# EAGLE design esp8266_relay_board (EAGLE 6.3)
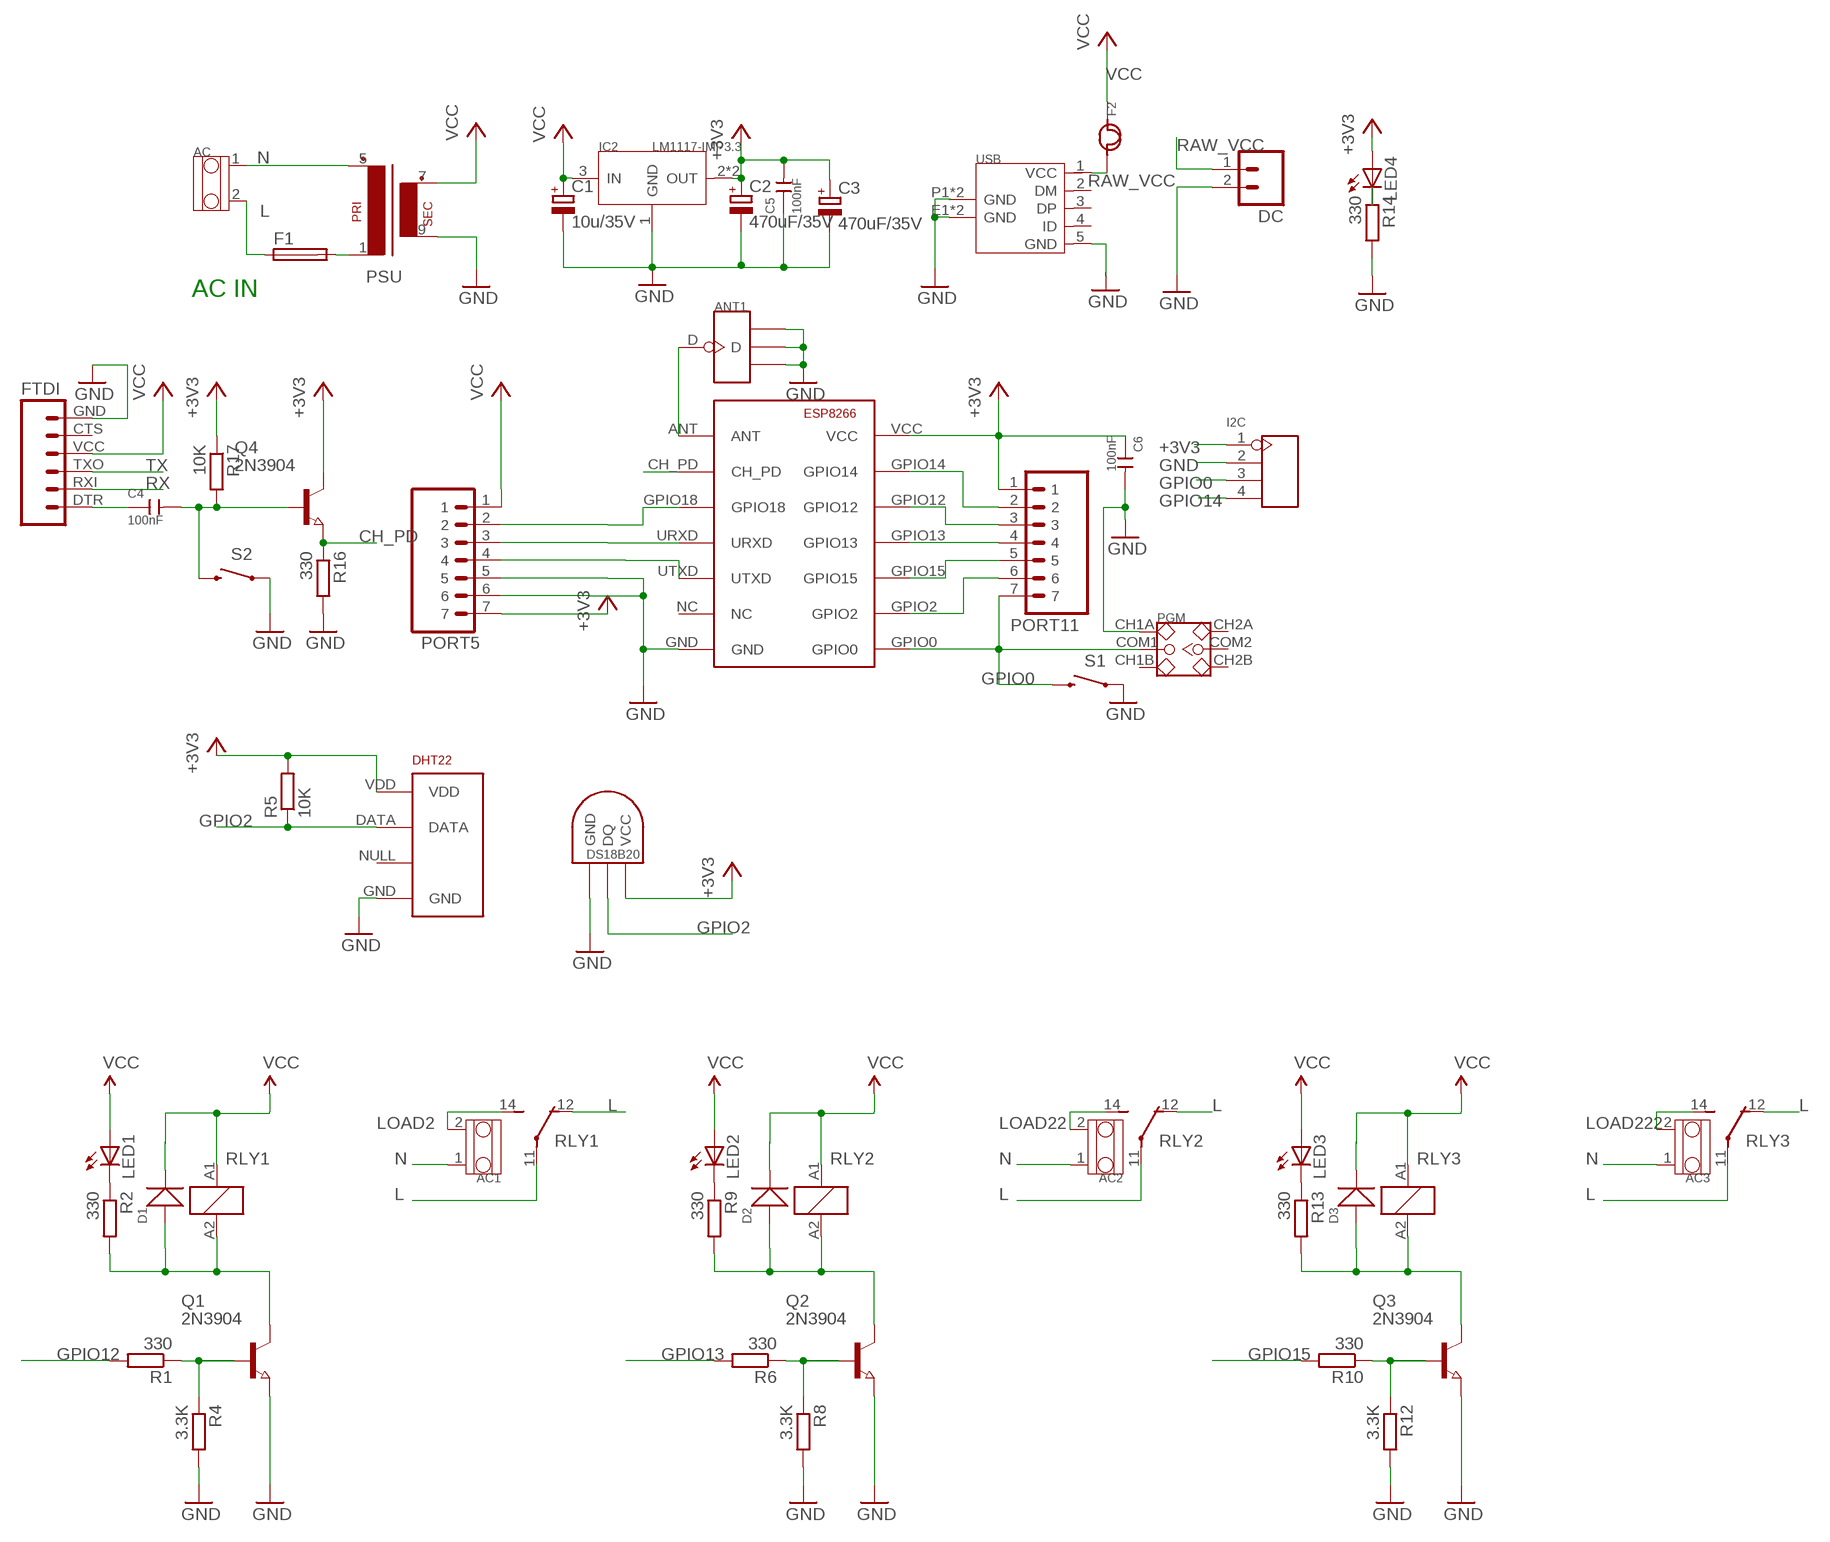
[diagram p0: schematic, sheet 1]

## Parts
AC  SCREW-TERMINAL-2P-3470110P1  [2P-5.0]
AC1  SCREW-TERMINAL-2P-3470110P1  [2P-5.0]
AC2  SCREW-TERMINAL-2P-3470110P1  [2P-5.0]
AC3  SCREW-TERMINAL-2P-3470110P1  [2P-5.0]
ANT1  U-FL-CONNECTOR-3450020P1  [U-FL]
C1  10u/35V  CPOL-EUSMCC  [SMC_C]
C2  470uF/35V  CPOL-EUSMCC  [SMC_C]
C3  470uF/35V  CPOL-EUSMCC  [SMC_C]
C4  100nF  CAP-0603  [C0603]
C5  100nF  CAP-0603  [C0603]
C6  100nF  CAP-0603  [C0603]
D1  DIODE'1206'  [SOD-123]
D2  DIODE'1206'  [SOD-123]
D3  DIODE'1206'  [SOD-123]
DC  M02LOCK  [1X02_LOCK]
DHT22  RHT03_DHT-22_AM2302  [RHT03_DHT-22]
ESP8266  ESP8266  ESP8266-04  [ESP-04]
F1  FUSEBLANK_5X20MM  [FUSE_HOLDER_5X20MM]
F2  FUSE-1206  [F1206]
FTDI  FTDI_BASICPTH  [FTDI_BASIC]
I2C  HEADER-4P-65/35MIL  [4P-2.54-65/35MIL]
IC2  LM1117-IMP3.3  CJ1117-3.3-1310190P1  [SOT223]
LED1  LEDSML0603  [SML0603]
LED2  LEDSML0603  [SML0603]
LED3  LEDSML0603  [SML0603]
LED4  LEDSML0603  [SML0603]
PGM  SWITCH-2CH-6P-90D  [6P-2CH-2.54-L9.0XW3.5XH3.2-90D]
PORT5  CON7PIN-PAD  [PORT7PAD]
PORT11  CON7PIN-PAD  [PORT7PAD]
PSU  VV11  [VV11]
Q1  2N3904  NPN-TRANSISTOR_SOT23  [SOT23]
Q2  2N3904  NPN-TRANSISTOR_SOT23  [SOT23]
Q3  2N3904  NPN-TRANSISTOR_SOT23  [SOT23]
Q4  2N3904  NPN-TRANSISTOR_SOT23  [SOT23]
R1  330  R-EU_R0603  [R0603]
R2  330  R-EU_R0603  [R0603]
R4  3.3K  R-EU_R0603  [R0603]
R5  10K  R-EU_R0603  [R0603]
R6  330  R-EU_R0603  [R0603]
R8  3.3K  R-EU_R0603  [R0603]
R9  330  R-EU_R0603  [R0603]
R10  330  R-EU_R0603  [R0603]
R12  3.3K  R-EU_R0603  [R0603]
R13  330  R-EU_R0603  [R0603]
R14  330  R-EU_R0603  [R0603]
R16  330  R-EU_R0603  [R0603]
R17  10K  R-EU_R0603  [R0603]
RLY1  RT114005  [RT-C/O12A3.5]
RLY2  RT114005  [RT-C/O12A3.5]
RLY3  RT114005  [RT-C/O12A3.5]
S1  !RESET  SWITCH-MOMENTARY-2SMD  [TACTILE_SWITCH_SMD]
S2  !RESET  SWITCH-MOMENTARY-2SMD  [TACTILE_SWITCH_SMD]
U$1  DS1820TO92  [DS1820]
USB  MICRO-USB-5P-340015001  [B-SMD-5P]

## Nets
+3V3 [power]: C2.+ C3.+ C5.2 C6.1 DHT22.VDD ESP8266.VCC I2C.1 IC2.2(OUT) IC2.TER(OUT) LED4.A PORT5.7 PORT11.1 Q4.3(C) R5.2 R17.1 U$1.VDD(VCC)
CH_PD [power]: ESP8266.CH_PD Q4.2(E) R16.1
GND [power]: ANT1.GND1 ANT1.GND2 ANT1.GND3 C1.- C2.- C3.- C5.1 C6.2 DC.2 DHT22.GND ESP8266.GND FTDI.GND I2C.2 IC2.1(GND) PGM.CH1A PORT5.5 PORT5.6 PSU.9(S4) Q1.2(E) Q2.2(E) Q3.2(E) R4.2 R8.2 R12.2 R14.2 R16.2 S1.1 S2.1 U$1.GND USB.5(GND) USB.E1(GND) USB.E2(GND) USB.P1(GND) USB.P2(GND)
GPIO0: ESP8266.GPIO0 I2C.3 PGM.COM1 PORT11.7 S1.3
GPIO2: DHT22.DATA ESP8266.GPIO2 PORT11.6 R5.1 U$1.DQ
GPIO12: ESP8266.GPIO12 PORT11.3 R1.2
GPIO13: ESP8266.GPIO13 PORT11.4 R6.2
GPIO14: ESP8266.GPIO14 I2C.4 PORT11.2
GPIO15 [power]: ESP8266.GPIO15 PORT11.5 R10.2
GPIO16: ESP8266.GPIO18 PORT5.2
L [220V Traf]: AC.2 F1.1 RLY1.11(2:P) RLY1.12(2:O) RLY2.11(2:P) RLY2.12(2:O) RLY3.11(2:P) RLY3.12(2:O)
LOAD2 [220V]: AC1.2 RLY1.14(2:S)
LOAD22 [220V]: AC2.2 RLY2.14(2:S)
LOAD222 [220V]: AC3.2 RLY3.14(2:S)
N [220V Traf]: AC1.1 AC2.1 AC3.1 AC.1 PSU.5(P2)
N$1: Q1.1(B) R1.1 R4.1
N$2: Q2.1(B) R6.1 R8.1
N$4: LED2.C R9.1
N$6 [power]: D2.+ Q2.3(C) R9.2 RLY2.A2
N$8: LED1.C R2.1
N$9: Q3.1(B) R10.1 R12.1
N$10: LED3.C R13.1
N$12 [power]: D3.+ Q3.3(C) R13.2 RLY3.A2
N$13: C4.1 FTDI.DTR
N$15 [220V Traf]: F1.2 PSU.1
N$16: LED4.C R14.1
N$17 [antenna]: ANT1.D ESP8266.ANT
N$19 [power]: D1.+ Q1.3(C) R2.2 RLY1.A2
N$20: C4.2 Q4.1(B) R17.2 S2.3
RAW_VCC [power]: DC.1 F2.2 USB.1(VCC)
RX: ESP8266.UTXD FTDI.RXI PORT5.4
TX: ESP8266.URXD FTDI.TXO PORT5.3
VCC [power]: C1.+ D1.- D2.- D3.- F2.1 FTDI.VCC IC2.3(IN) LED1.A LED2.A LED3.A PORT5.1 PSU.7(S3) RLY1.A1 RLY2.A1 RLY3.A1
Unconnected: DHT22.NULL ESP8266.NC FTDI.CTS PGM.CH1B PGM.CH2A PGM.CH2B PGM.COM2 USB.2(DM) USB.3(DP) USB.4(ID)

## Notes on the sheet
- AC IN

## Library data of the parts
AC AC1-AC3 = Connector:SCREW-TERMINAL-2P
ANT1 = Connector:U-FL-CONNECTOR
C1-C3 = rcl:CPOL-EU: POLARIZED CAPACITOR, European symbol
C4-C6 = Discrete:CAP: Ceramic Capacitors
D1-D3 = Discrete:DIODE*
DC = SparkFun-Connectors:M02: Standard 2-pin 0.1" header. Use with - straight break away headers ( PRT-00116) - right angle break away headers (PRT-00553) - swiss pins (PRT-00743) - machine pins (PRT-00117) - female headers (PRT-00115) Molex polarized connector foot print use with: PRT-08233 with associated crimp pins and housings. 2.54_SCREWTERM for use with PRT-10571. 3.5mm Screw Terminal footprints for PRT-08084 5mm Screw Terminal footprints for use with PRT-08433
DHT22 = RHT03_DHT-22_AM2302:RHT03_DHT-22_AM2302: RHT03 / DHT-22 / AM2302 Packages and symbol for the RHT03 / DHT-22 relative humidity and temperature sensor. Note: The AM2302 is a wired version of the DHT-22 which typically requires less clearance and is thus provided as a separate package.; PROD_ID: SEN-10167
ESP8266 = ESP8266:ESP8266: low cost Wifi to Serial Module
F1 = fuse:FUSE: Fuse; OC_FARNELL: unknown; OC_NEWARK: unknown
F2 = Discrete:FUSE
FTDI = SparkFun:FTDI_BASIC: FTDI Basic: 3.3V and 5V
I2C = Connector:HEADER-4P
IC2 = IC:CJ1117-3.3: 1A Low Dropout Linear Regulator
LED1-LED4 = led:LED: LED OSRAM: - CHIPLED LG R971, LG N971, LY N971, LG Q971, LY Q971, LO R971, LY R971 LH N974, LH R974 LS Q976, LO Q976, LY Q976 LO Q996 - Hyper CHIPLED LW Q18S LB Q993, LB Q99A, LB R99A - SideLED LS A670, LO A670, LY A670, LG A670, LP A670 LB A673, LV A673, LT A673, LW A673 LH A674 LY A675 LS A676, LA A676, LO A676, LY A676, LW A676 LS A679, LY A679, LG A679 - Hyper Micro SIDELED® LS Y876, LA Y876, LO Y876, LY Y876 LT Y87S - SmartLED LW L88C, LW L88S LB L89C, LB L89S, LG L890 LS L89K, LO L89K, LY L89K LS L896, LA L896, LO L896, LY L896 - TOPLED LS T670, LO T670, LY T670, LG T670, LP T670 LSG T670, LSP T670, LSY T670, LOP T670, LYG T670 LG T671, LOG T671, LSG T671 LB T673, LV T673, LT T673, LW T673 LH T674 LS T676, LA T676, LO T676, LY T676, LB T676, LH T676, LSB T676, LW T676 LB T67C, LV T67C, LT T67C, LS T67K, LO T67K, LY T67K, LW E67C LS E67B, LA E67B, LO E67B, LY E67B, LB E67C, LV E67C, LT E67C LW T67C LS T679, LY T679, LG T679 LS T770, LO T770, LY T770, LG T770, LP T770 LB T773, LV T773, LT T773, LW T773 LH T774 LS E675, LA E675, LY E675, LS T675 LS T776, LA T776, LO T776, LY T776, LB T776 LHGB T686 LT T68C, LB T68C - Hyper Mini TOPLED® LB M676 - Mini TOPLED Santana® LG M470 LS M47K, LO M47K, LY M47K Source: http://www.osram.convergy.de LUXEON: - LUMILED® LXK2-PW12-R00, LXK2-PW12-S00, LXK2-PW14-U00, LXK2-PW14-V00 LXK2-PM12-R00, LXK2-PM12-S00, LXK2-PM14-U00 LXK2-PE12-Q00, LXK2-PE12-R00, LXK2-PE12-S00, LXK2-PE14-T00, LXK2-PE14-U00 LXK2-PB12-K00, LXK2-PB12-L00, LXK2-PB12-M00, LXK2-PB14-N00, LXK2-PB14-P00, LXK2-PB14-Q00 LXK2-PR12-L00, LXK2-PR12-M00, LXK2-PR14-Q00, LXK2-PR14-R00 LXK2-PD12-Q00, LXK2-PD12-R00, LXK2-PD12-S00 LXK2-PH12-R00, LXK2-PH12-S00 LXK2-PL12-P00, LXK2-PL12-Q00, LXK2-PL12-R00 Source: www.luxeon.com KINGBRIGHT: KA-3528ASYC Source: www.kingbright.com
PGM = Discrete:SWITCH-2CH-6P: 6P-2CH-2.54-L9.0*W3.5*H3.2+2.0MM:311010004;6P-2CH-2.54-L9.0*W3.5*H3.2-90D:311030004;6P-2CH-2.54-SMD-L7.0*W3.5*H1.5MM:311030005
PORT5 PORT11 = Port7Pin:CON7PIN: PIN HEADER
PSU = trafo:VV11: TRANSFORMER 1 primary winding, 1 secondary winding BLOCK
Q1-Q4 = semicon-smd-ipc:NPN-TRANSISTOR_: NPN TRANSISTOR
R1 R2 R4-R6 R8-R10 R12-R14 R16 R17 = rcl:R-EU_: RESISTOR, European symbol
RLY1-RLY3 = relay:RT?1*: Power PCB Relayl SCHRACK 1 pole 12 / 16 A, DC- or AC-coi Source: http://www.schrack.com/.. 5819.pdf; MPN: RT114005; OC_FARNELL: 1629035; OC_NEWARK: 03P2411
S1 S2 = SparkFun-Electromechanical:SWITCH-MOMENTARY-2: Various NO switches- pushbuttons, reed, etc; PROD_ID: SWCH-08247
U$1 = Ava:DS1820: DS18B20 Programmable Resolution 1-Wire Digital Thermometer Description The DS18B20 digital thermometer provides 9-bit to 12-bit Celsius temperature measurements and has an alarm function with nonvolatile user-programmable upper and lower trigger points. The DS18B20 communicates over a 1-Wire® bus that by definition requires only one data line (and ground) for communication with a central microprocessor. It has an operating temperature range of -55°C to +125°C and is accurate to ±0.5°C over the range of -10°C to +85°C. In addition, the DS18B20 can derive power directly from the data line ("parasite power"), eliminating the need for an external power supply. Each DS18B20 has a unique 64-bit serial code, which allows multiple DS18B20s to function on the same 1-Wire bus. Thus, it is simple to use one microprocessor to control many DS18B20s distributed over a large area. Applications that can benefit from this feature include HVAC environmental controls, temperature monitoring systems inside buildings, equipment, or machinery, and process monitoring and control systems.
USB = Connector:MICRO-USB-5P: When you use the footprint ,place notice 46 (layer)milling ,there is some important information.

## Net classes
0 default: width 0.254 mm, drill 1 mm, clearance 0.254 mm
1 power: width 0.305 mm, drill 1 mm, clearance 0.305 mm
2 220V: width 3.81 mm, drill 1 mm, clearance 1.524 mm
3 antenna: width 0.61 mm, drill 1 mm, clearance 0.508 mm
4 220V Traf: width 2.286 mm, drill 0.8 mm, clearance 1.016 mm

## Board
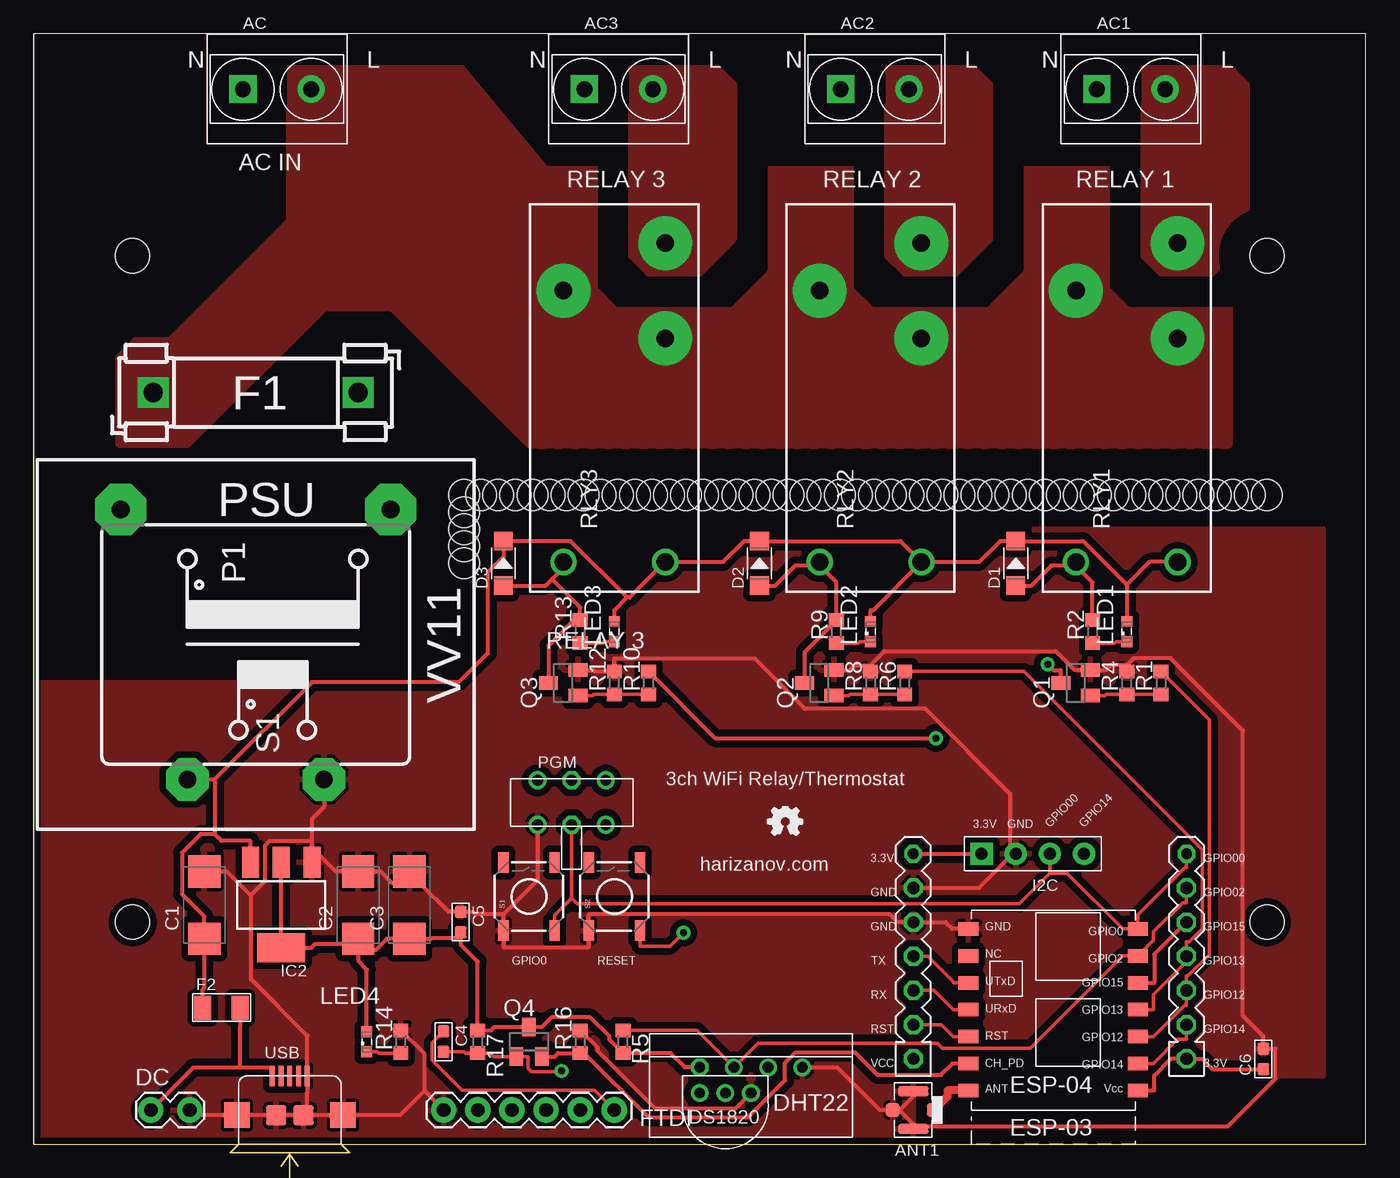
[diagram p1: board, top side]
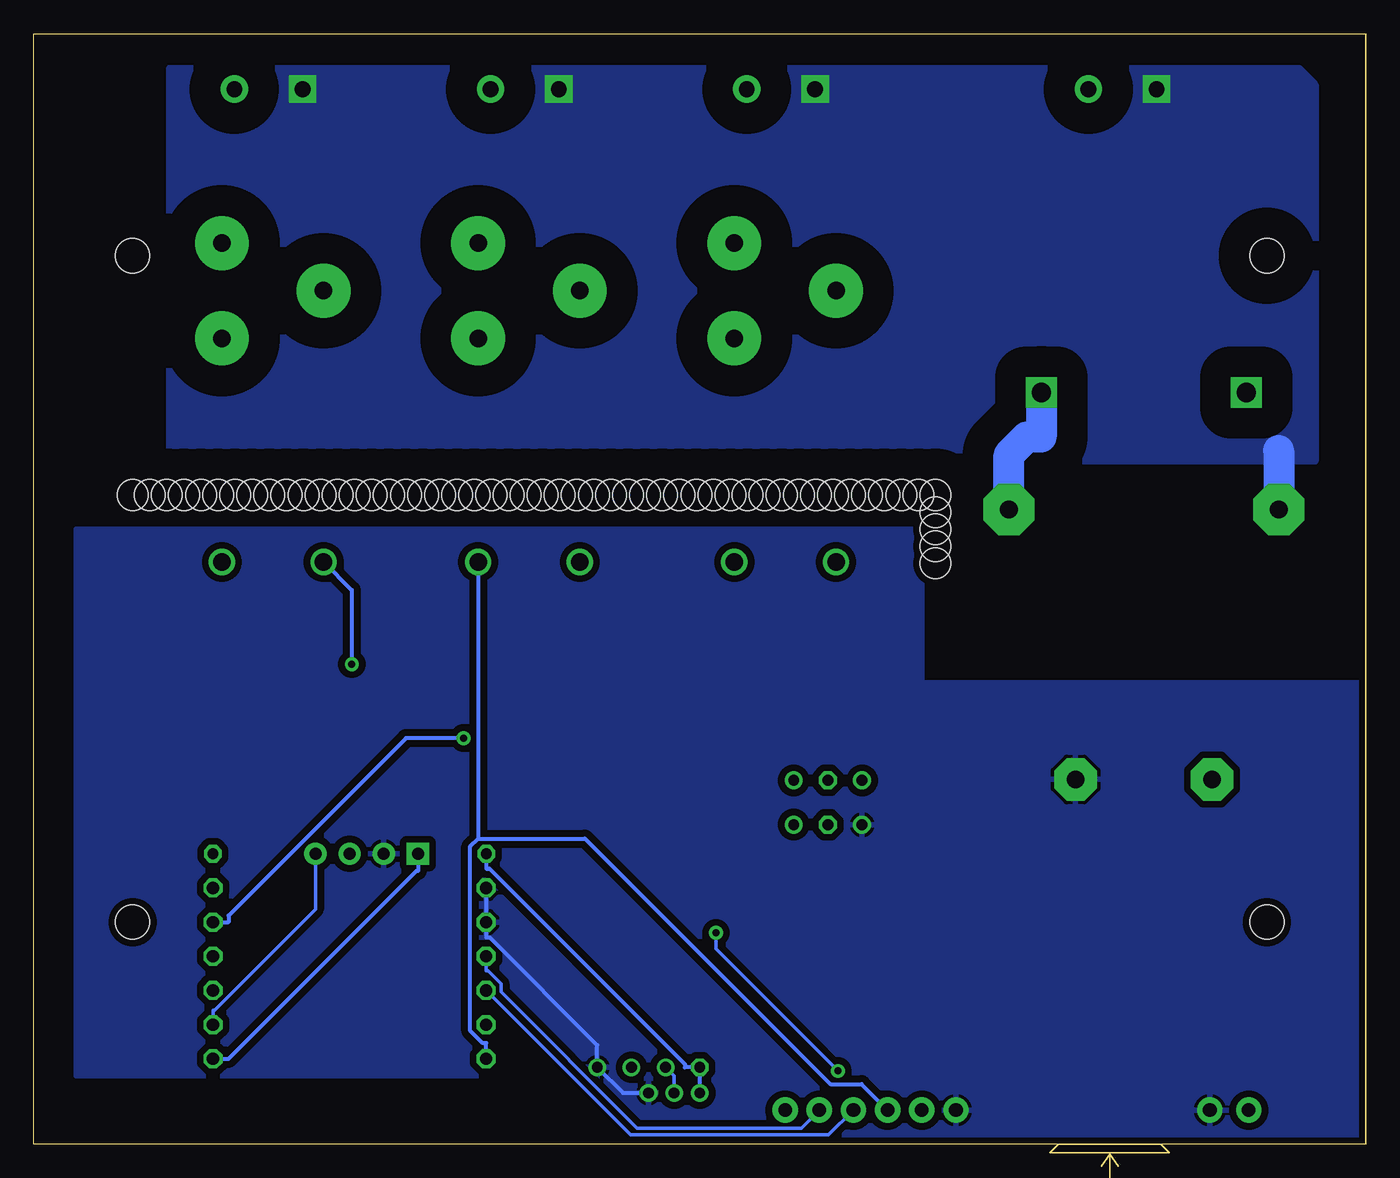
[diagram p2: board, bottom side, seen from below]

Size 99.06 x 82.55 mm. Coordinates in mm from the lower left corner, seen from the top.
Outline: 0,82.55 99.06,82.55 99.06,0 38.11,0 0,0
Outline: 0,0 0,82.55
Outline: 0,82.55 0,0
Outline: 0,0 0,82.55
Copper layers (1*16): Top 0.07mm / dielectric 2mm / Bottom 0.07mm
Design rules "default *": minimum track width 10mil, minimum drill 20mil, track to track 5mil, track to pad 5mil, pad to pad 5mil, via to via 5mil, smd to smd 0mil, copper to edge 10mil, drill to drill 10mil, minimum pad ring 10mil, minimum via ring 10mil, stop-mask expansion 2mil, vias tented up to drill 25mil, thermal gap 10mil
Holes 2.54 mm at 7.37,66.04 7.37,16.51 91.69,66.04 91.69,16.51
Holes 2.29 mm at 40.89,48.26 39.62,48.26 38.35,48.26 42.16,48.26 43.43,48.26 44.7,48.26 45.97,48.26 47.24,48.26 48.51,48.26 59.94,48.26 58.67,48.26 57.4,48.26 61.21,48.26 62.48,48.26 63.75,48.26 65.02,48.26 66.29,48.26 67.56,48.26 78.99,48.26 77.72,48.26 76.45,48.26 80.26,48.26 81.53,48.26 82.8,48.26 84.07,48.26 85.34,48.26 86.61,48.26 49.78,48.26 48.51,48.26 47.24,48.26 51.05,48.26 52.32,48.26 53.59,48.26 54.86,48.26 56.13,48.26 57.4,48.26 70.1,48.26 68.83,48.26 67.56,48.26 71.37,48.26 72.64,48.26 73.91,48.26 75.18,48.26 76.45,48.26 77.72,48.26 34.54,48.26 33.27,48.26 32,48.26 35.81,48.26 37.08,48.26 38.35,48.26 39.62,48.26 40.89,48.26 42.16,48.26 43.43,48.26 42.16,48.26 40.89,48.26 44.7,48.26 87.88,48.26 89.15,48.26 90.42,48.26 91.69,48.26 32,46.99 32,45.72 32,44.45 32,43.18
tKeepout: 2 lines
bKeepout: 2 lines
tRestrict: 2 lines
bRestrict: 2 lines

### Footprints (pad centres in the part's own frame; a part is rotated, then mirrored left to right if it is on the bottom)
2P-5.0 = drill 1.168 pad 2.032 square: 1 -2.54,0 | drill 1.168 pad 2.032: 2 2.54,0
U-FL = smd 1.016 x 1.016: D -1.524,0; GND3 1.524,0 | smd 2.286 x 0.762: GND1 0,1.397; GND2 0,-1.397
SMC_C = smd 2.4 x 2.4: + -2.5,0; - 2.5,0
C0603 = smd 0.889 x 0.889: 1 -0.762,0; 2 0.762,0
SOD-123 = smd 1.397 x 1.397: + -1.651,0; - 1.651,0
1X02_LOCK = drill 1.016 pad 1.88: 1 -0.178,0; 2 2.718,0
RHT03_DHT-22 = drill 0.8: DATA -1.27,0; GND 3.81,0; NULL 1.27,0 | drill 0.8 octagon: VDD -3.81,0
ESP-04 = smd 1 x 1.5: ANT 1.46,12.4; CH_PD 3.46,12.4; GND 13.46,12.4; GPIO0 13.46,-0.2; GPIO2 11.46,-0.2; GPIO12 5.46,-0.2; GPIO13 7.46,-0.2; GPIO14 3.46,-0.2; GPIO15 9.46,-0.2; GPIO18 5.46,12.4; NC 11.46,12.4; URXD 7.46,12.4; UTXD 9.46,12.4; VCC 1.46,-0.2
FUSE_HOLDER_5X20MM = drill 1.422 pad 2.286 square: 1 0,0; 2 15.24,0
F1206 = smd 1.27 x 1.778: 1 -1.397,0; 2 1.397,0
FTDI_BASIC = drill 1.016 pad 1.88: CTS 10.16,0; DTR 0,0; GND 12.7,0; RXI 2.54,0; TXO 5.08,0; VCC 7.62,0
4P-2.54-65/35MIL = drill 0.889 pad 1.651 square: 1 0,3.81 | drill 0.889 pad 1.651: 2 0,1.27; 3 0,-1.27; 4 0,-3.81
SOT223 = smd 1.27 x 2.286: 1 -2.286,-3.175; 2 0,-3.175; 3 2.286,-3.175 | smd 3.556 x 2.159: TER 0,3.175
SML0603 = smd 0.8 x 0.8: A 0.75,0; C -0.75,0
6P-2CH-2.54-L9.0XW3.5XH3.2-90D = drill 0.813 pad 1.27: CH1A -2.54,-1.65; CH1B 2.54,-1.65; CH2A -2.54,1.65; CH2B 2.54,1.65 | drill 0.813 pad 1.27 octagon: COM1 0,-1.65; COM2 0,1.65
PORT7PAD = drill 0.9 octagon: 1 -6.35,0; 2 -3.81,0; 3 -1.27,0; 4 1.27,0; 5 3.81,0; 6 6.35,0 | drill 0.8 octagon: 7 8.89,0
VV11 = drill 1.321 pad 3.81 octagon: 1 -10.033,10.033; 5 -10.033,-10.033 | drill 1.321 pad 3.175 octagon: 7 10.033,-5.08; 9 10.033,5.08
SOT23 = smd 1 x 1.4: 1 -0.95,-1.1; 2 0.95,-1.1; 3 0,1.1
R0603 = smd 1 x 1.1: 1 -0.85,0; 2 0.85,0
RT-C/O12A3.5 = drill 1.3 pad 4: 11 7.56,3.78; 12 4.02,-3.78; 14 11.1,-3.78 | drill 1.3: A1 -12.6,-3.78; A2 -12.6,3.78
TACTILE_SWITCH_SMD = smd 1.524 x 0.762: 1 -2.54,1.905; 2 2.54,1.905; 3 -2.54,-1.905; 4 2.54,-1.905
DS1820 = drill 0.8: DQ 2.54,-1.27; GND 0.635,-1.27; VDD 4.445,-1.27
B-SMD-5P = smd 0.38 x 1.52: 1 -1.3,2.54; 2 -0.65,2.54; 3 0,2.54; 4 0.65,2.54; 5 1.3,2.54 | smd 1.524 x 1.524: E1 -1.016,-0.381; E2 1.016,-0.381 | smd 1.9 x 1.9: P1 -3.95,-0.381; P2 3.95,-0.381

### Placement (x,y rotation side)
AC  18.1,78.42 0 top
AC1  81.6,78.42 0 top
AC2  62.55,78.42 0 top
AC3  43.5,78.42 0 top
ANT1  65.41,2.54 180 top
C1  12.7,17.78 90 top
C2  24.13,17.78 90 top
C3  27.94,17.78 90 top
C4  30.48,7.62 270 top
C5  31.75,16.51 270 top
C6  91.44,6.35 90 top
D1  73.03,43.18 90 top
D2  53.98,43.18 90 top
D3  34.92,43.18 90 top
DC  8.89,2.54 0 top
DHT22  53.34,5.71 0 top
ESP8266  81.92,2.54 90 top
F1  8.89,55.88 0 top
F2  13.97,10.16 0 top
FTDI  43.18,2.54 180 top
I2C  74.3,21.59 90 top
IC2  18.41,17.78 180 top
LED1  81.28,38.1 90 top
LED2  62.23,38.1 90 top
LED3  43.18,38.1 90 top
LED4  24.77,7.62 90 top
PGM  40.01,25.4 0 top
PORT5  65.41,12.7 90 top
PORT11  85.72,12.7 90 top
PSU  16.51,37.15 270 top
Q1  77.47,34.29 90 top
Q2  58.42,34.29 90 top
Q3  39.37,34.29 90 top
Q4  36.83,7.62 0 top
R1  83.82,34.29 90 top
R2  78.74,38.1 90 top
R4  81.28,34.29 90 top
R5  43.81,7.62 270 top
R6  64.77,34.29 90 top
R8  62.23,34.29 90 top
R9  59.69,38.1 90 top
R10  45.72,34.29 90 top
R12  43.18,34.29 90 top
R13  40.64,38.1 90 top
R14  27.3,7.62 90 top
R16  40.64,7.62 90 top
R17  33.02,7.62 270 top
RLY1  81.28,55.88 90 top
RLY2  62.23,55.88 90 top
RLY3  43.18,55.88 90 top
S1  36.83,18.41 90 top
S2  43.18,18.41 90 top
U$1  53.98,2.54 180 top
USB  19.05,2.54 0 top

### Tracks (layer width: path | path; a pad name or v marks a point on that pad's centre or on a via)
+3V3
  Top 0.305: 19.16,14.61 18.41,15.35 IC2.2 | 19.16,14.61 20.65,14.61 20.91,14.87 24.13,14.87 | IC2.TER 19.16,14.61 | 24.13,14.87 24.13,14.45 | C2.+ 24.13,14.87 | 31.75,15.3 29.61,15.3 29.6,15.28 C3.+ 26.28,15.28 25.45,14.45 24.13,14.45 | 31.75,15.3 31.75,14.85 33.02,13.58 R17.1 33.52,8.47 34.03,8.47 34.28,8.72 Q4.3 37.79,8.72 38.49,9.43 41.39,9.43 42.81,8.01 42.81,7.78 R5.2 47.36,6.77 48.42,5.71 DHT22.VDD | C5.2 31.75,15.3 | 24.13,14.45 24.13,13.62 24.77,12.99 LED4.A | ESP8266.VCC 83.32,4 83.32,5.11 84.56,6.35 PORT11.1 86.89,6.35 87.65,5.59 C6.1 | PORT5.7 I2C.1
  Bottom 0.305: PORT11.1 84.56,6.35 70.61,20.31 70.48,20.31 I2C.1 | PORT5.7 65.41,20.48 65.17,20.48 50.64,5.95 50.64,5.71 DHT22.VDD U$1.VDD
CH_PD
  Top 0.305: ESP8266.CH_PD 68.31,6 67.47,5.16 62.75,5.16 61.08,6.83 56.65,6.83 55.88,6.06 55.88,4.74 53.13,1.99 45.72,1.99 40.94,6.77 R16.1 38.99,6.77 38.74,6.52 Q4.2
GND
  Top 0.305: 65.41,1.32 88.78,1.32 92.34,4.88 92.34,7.11 C6.2 91.44,8.01 89.91,9.54 89.91,30.75 84.53,36.14 81.8,36.14 81.28,35.62 | 65.41,1.32 ANT1.GND1 | 64.36,2.54 65.41,1.5 65.41,1.32 | 72.64,21.59 72.64,26.03 66.3,32.37 57.35,32.37 53.62,36.1 43.18,36.1 R12.2 41.73,35.14 41.63,35.24 Q3.2 | 62.23,35.62 61.06,35.62 60.68,35.24 Q2.2 | 64.36,2.54 65.41,3.58 ANT1.GND2 | 16.13,18.51 14.36,20.28 C1.- | 16.13,18.51 16.16,18.47 16.16,12.26 20.35,8.07 USB.5 20.35,3.86 20.35,2.16 | 16.13,18.51 17.22,19.6 17.22,22.23 17.55,22.55 20.7,22.55 | DHT22.GND 59.74,5.71 62.92,2.54 ANT1.GND3 64.36,2.54 | 62.23,35.62 63.26,36.65 76,36.65 77.41,35.24 Q1.2 79.73,35.24 80.11,35.62 81.28,35.62 | 72.64,21.59 I2C.2 | PORT5.6 70.29,19.05 72.64,21.39 72.64,21.59 | 27.94,19.45 28.67,19.45 30.85,17.27 C5.1 32.65,17.27 32.83,17.09 34.92,17.09 | 27.94,19.45 26.62,19.45 25.79,20.28 C2.- 22.47,20.28 21,21.75 20.7,21.75 | 20.35,2.16 USB.E2 USB.E1 USB.P1 11.99,2.16 DC.2 | 20.35,2.16 USB.P2 27.25,2.16 29.06,3.96 | R4.2 81.28,35.62 | R8.2 62.23,35.62 | U$1.GND 52.18,2.65 46.23,2.65 41.95,6.92 41.95,7.16 R16.2 | 34.92,17.09 S1.1 34.92,14.66 41.27,14.66 S2.1 41.27,17.09 63.66,17.09 64.24,16.51 PORT5.5 67.8,16.51 68.31,16 ESP8266.GND | 29.06,3.96 29.06,6.72 R14.2 | FTDI.GND 29.06,3.96 | PSU.9 21.59,25.07 20.7,24.18 20.7,22.55 | C3.- 27.94,19.45 | 20.7,21.75 20.7,22.55 | IC2.1 20.7,21.75 | PGM.CH1A 37.47,19.63 34.92,17.09
  Bottom 0.305: U$1.GND 55.24,3.81 DHT22.GND 57.15,7.36 65.13,15.35 65.41,15.35 PORT5.5 PORT5.6
  pour Top (isolate 0.508): 65.41,-3.81 -1.27,-3.81 -1.27,34.29 33.34,34.29 32.38,34.61 32.38,45.72 95.89,45.72 95.89,5.08 65.41,5.08
  pour Bottom (isolate 0.508): -0.64,-2.54 -0.64,34.29 33.02,34.29 33.02,45.72 95.89,45.72 95.89,5.08 65.41,5.08 65.41,-2.54
GPIO0
  Top 0.254: 40.01,18.29 PGM.COM1 | 40.01,18.29 38.73,17.02 S1.3 | 75.56,20.16 73.28,17.87 40.42,17.87 40.01,18.29 | 75.56,20.16 76.83,20.16 80.98,16 ESP8266.GPIO0 82.11,17.07 85.6,20.55 85.72,20.55 PORT11.7 | I2C.3 75.56,20.16
GPIO2
  Top 0.254: R5.1 49.31,8.47 DHT22.DATA 53.85,7.49 67.22,7.49 67.59,7.12 74.1,7.12 80.98,14 ESP8266.GPIO2 83.27,15.15 83.27,15.78 85.45,17.96 85.72,17.96 PORT11.6
  Bottom 0.254: U$1.DQ 51.44,5.08 DHT22.DATA
GPIO12
  Top 0.254: R1.2 87.41,31.55 87.41,14.08 85.84,12.52 85.72,12.52 PORT11.3 85.72,10.35 85.59,10.35 83.25,8 ESP8266.GPIO12
GPIO13
  Top 0.254: R6.2 73.64,35.14 86.9,21.88 86.9,16 85.95,15.05 85.72,15.05 PORT11.4 85.72,13.58 83.25,11.1 83.25,10 ESP8266.GPIO13
GPIO14
  Top 0.254: PORT11.2 85.72,7.8 85.05,7.8 83.25,6 ESP8266.GPIO14
  Bottom 0.254: PORT11.2 85.72,9.97 85.61,9.97 78.11,17.48 I2C.4
GPIO15  (via drill 0.51 pad 1.02)
  Top 0.305: R10.2 50.68,30.18 v67.09,30.18 | ESP8266.GPIO15 83.32,12 83.32,14.11 PORT11.5
  Bottom 0.305: PORT11.5 84.56,16.51 84.56,16.99 71.37,30.18 v67.09,30.18
GPIO16
  Top 0.254: ESP8266.GPIO18 68.38,8 67.49,8.89 PORT5.2
L
  pour Top (isolate 2.286, rank 2, no thermals): 19.05,80.01 19.05,68.58 10.16,59.69 7.62,59.69 6.35,58.42 6.35,52.07 11.43,52.07 21.59,62.23 26.67,62.23 38.1,50.8 87.63,50.8 88.9,52.07 88.9,72.39 38.1,72.39 31.75,80.01
LOAD2
  pour Top (isolate 2.286, no thermals): 83.82,64.77 87.63,64.77 90.17,67.31 90.17,78.74 87.63,81.28 83.82,81.28 82.55,80.01 82.55,66.04
  pour Top (isolate 2.286, no thermals): 83.82,64.77 87.63,64.77 90.17,67.31 90.17,78.74 87.63,81.28 83.82,81.28 82.55,80.01 82.55,66.04
LOAD22
  pour Top (isolate 2.286, no thermals): 64.77,64.77 68.58,64.77 71.12,67.31 71.12,78.74 68.58,81.28 64.77,81.28 63.5,80.01 63.5,66.04
LOAD222
  pour Top (isolate 2.286, no thermals): 45.72,64.77 49.53,64.77 52.07,67.31 52.07,78.74 49.53,81.28 45.72,81.28 44.45,80.01 44.45,66.04
N
  Bottom 2.286: 6.48,51.55 PSU.5
  pour Bottom (isolate 2.286, no thermals): 6.35,81.28 3.81,78.74 3.81,50.8 88.9,50.8 88.9,80.01 87.63,81.28
N$1
  Top 0.254: R1.1 R4.1 79.75,33.44 79.65,33.34 Q1.1
N$2
  Top 0.254: Q2.1 60.6,33.34 60.7,33.44 R8.1 R6.1
N$4
  Top 0.254: LED2.C 61.45,37.35 61.35,37.25 R9.1
N$6
  Top 0.305: Q2.3 57.32,36.58 R9.2 59.69,41.77 58.45,43.01 | 58.45,43.01 56.61,43.01 55.13,41.53 D2.+ | RLY2.A2 58.45,43.01
N$8
  Top 0.254: LED1.C 80.5,37.35 80.4,37.25 R2.1
N$9
  Top 0.254: R10.1 R12.1 41.65,33.44 41.55,33.34 Q3.1
N$10
  Top 0.254: LED3.C 42.4,37.35 42.3,37.25 R13.1
N$12
  Top 0.305: 38.54,42.01 39.4,42.87 RLY3.A2 | 38.54,42.01 38.06,41.53 35.5,41.53 D3.+ | 38.54,42.01 40.64,39.91 40.64,39.43 | 40.64,39.43 38.27,37.06 Q3.3 | R13.2 40.64,39.43
N$13
  Top 0.254: C4.1 29.64,7.54 29.64,6.24 31.87,4.01 41.71,4.01 FTDI.DTR
N$15
  Bottom 2.286: F1.2 24.13,52.58 25.21,52.58 26.54,51.24 PSU.1
N$16
  Top 0.254: LED4.C 25.55,6.87 25.65,6.77 R14.1
N$17
  Top 0.61: ESP8266.ANT 67.95,4 67.95,3.56 ANT1.D
N$19  (via drill 0.51 pad 1.02)
  Top 0.305: 77.5,43.01 75.66,43.01 74.18,41.53 D1.+ | R2.2 78.74,41.77 77.5,43.01 | RLY1.A2 77.5,43.01 | Q1.3 76.37,35.25 75.84,35.25 v75.41,35.68
  Bottom 0.305: RLY1.A2 75.41,41.19 v75.41,35.68
N$20  (via drill 0.51 pad 1.02)
  Top 0.254: S2.3 45.09,14.73 47.33,14.73 v48.32,15.72 | v39.26,5.45 39.19,5.39 37.01,5.39 36.76,5.64 36.76,6.52 Q4.1 34.2,6.52 33.95,6.77 R17.2 32.09,6.77 32,6.86 31.31,6.86 C4.2
  Bottom 0.254: v48.32,15.72 48.32,14.52 v39.26,5.45
RAW_VCC
  Top 0.305: 15.37,5.69 11.86,5.69 DC.1 | 15.37,5.69 17.75,5.69 USB.1 | 15.37,5.69 15.37,8.81 F2.2
RX
  Top 0.254: ESP8266.UTXD 68.38,12 68.38,12.08 66.49,13.97 PORT5.4
  Bottom 0.254: PORT5.4 65.41,12.88 65.27,12.88 64.32,11.94 64.32,11.34 54.19,1.2 41.98,1.2 FTDI.RXI
TX
  Top 0.254: ESP8266.URXD 68.38,10 66.95,11.43 PORT5.3
  Bottom 0.254: PORT5.3 54.67,0.7 39.94,0.7 FTDI.TXO
VCC
  Top 0.305: IC2.3 16.13,22.55 13.97,22.55 13.47,23.05 | 13.47,23.05 12.41,23.05 11.04,21.67 11.04,18.59 12.7,16.94 C1.+ 12.7,11.63 12.57,11.51 F2.1 | 13.47,27.11 13.47,23.05 | 13.47,27.11 20.7,34.34 31.62,34.34 33.77,36.49 33.77,42.52 34.92,43.67 D3.- 39.92,44.83 44.11,40.64 | 81.28,41.59 LED1.A | 81.28,41.59 78.04,44.83 D1.- 72.45,44.83 71.87,44.83 70.32,43.28 RLY2.A1 | RLY1.A1 82.97,43.28 81.28,41.59 | PSU.7 13.47,27.11 | 44.11,40.64 44.32,40.64 RLY3.A1 51.27,43.28 52.82,44.83 D2.- 64.46,44.83 RLY2.A1 | 44.11,40.64 43.18,39.71 LED3.A | LED2.A 62.23,39.71 62.44,39.71 RLY2.A1
  Bottom 0.305: 66.01,22.72 58.07,22.72 39.82,4.47 37.49,4.47 FTDI.VCC | 66.01,22.72 66.59,22.14 66.59,8.43 65.68,7.51 65.41,7.51 PORT5.1 | RLY2.A1 66.01,22.72

### Text on the board
tPlace: N | L | N | L | N | L | N | L | AC IN | RELAY 3 | RELAY 2 | RELAY 1 | RELAY 3 | 3ch WiFi Relay/Thermostat | 3.3V | GND | GPIO00 | GPIO14 | 3.3V | GPIO00 | harizanov.com | GND | GPIO02 | GND | GPIO15 | GPIO0 | RESET | TX | GPIO13 | RX | GPIO12 | RST | GPIO14 | VCC | 3.3V